# Altium schematic sheet Linear regulators.SchDoc (part 1 of 3)
size A3; Author: Mohamed Drissi; SheetNumber: 8; SheetTotal: 8
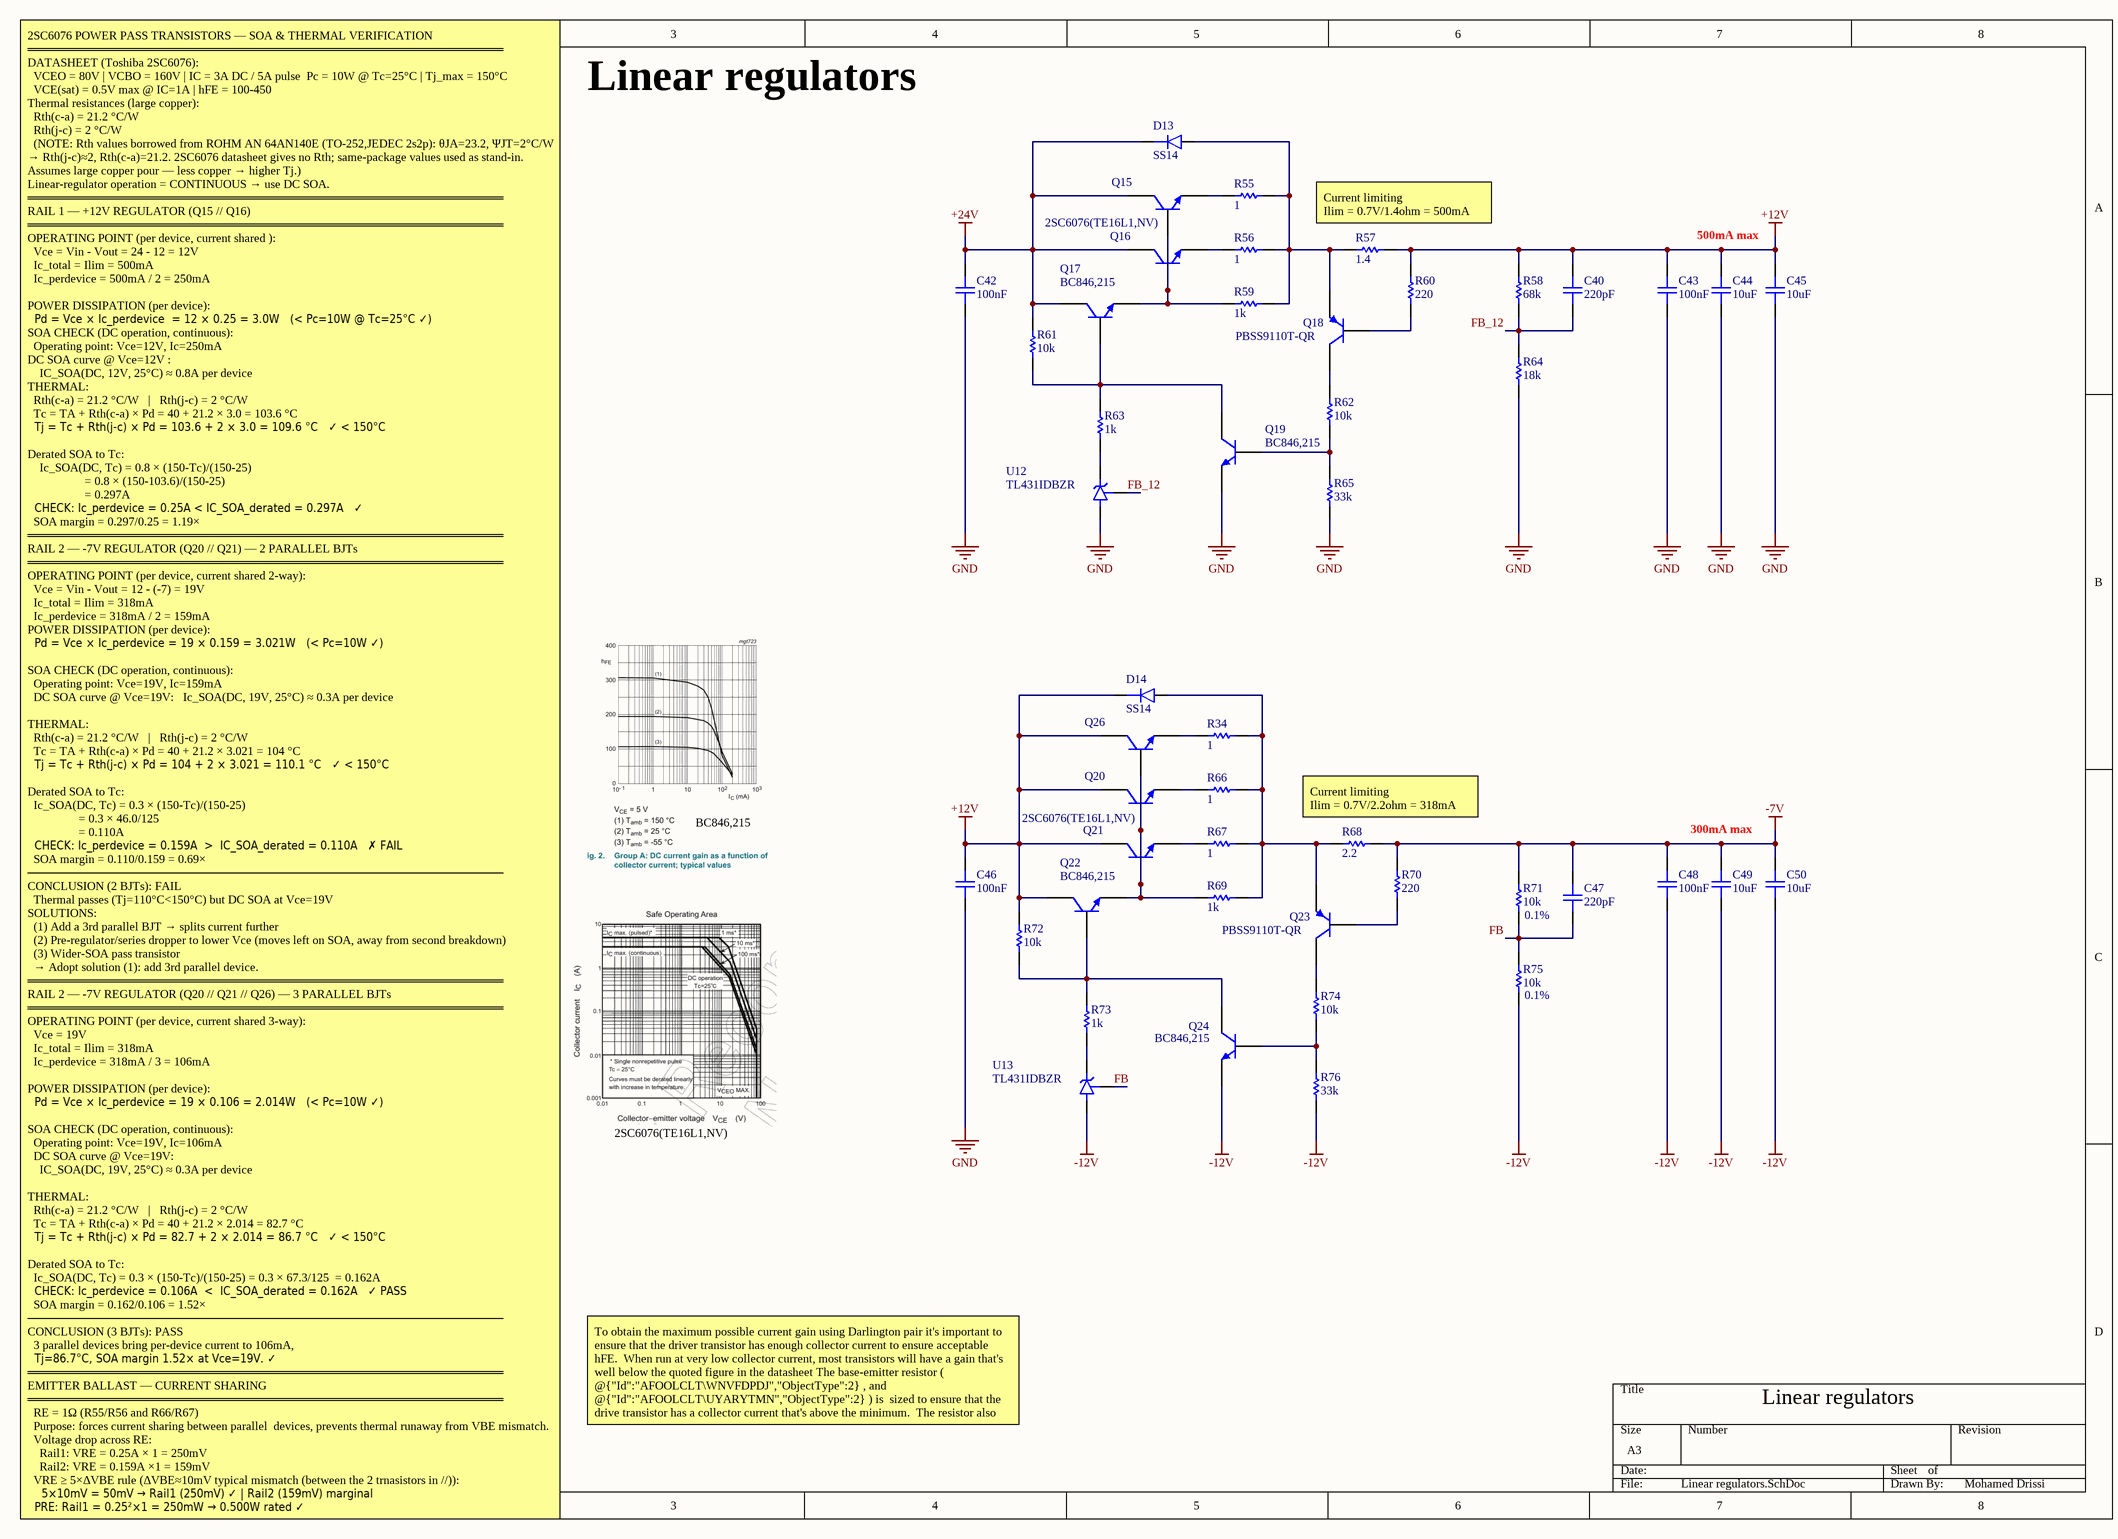
[diagram p0: Linear regulators.SchDoc]

## Parts
C40  Capacitance: 220pF  [cap_0603]  (hidden comment: CC0603JRNPO7BN221)
C42  Capacitance: 100nF  [cap_0603]  (hidden comment: GMC10X7R104K100NT)
C43  Capacitance: 100nF  [cap_0603]  (hidden comment: GMC10X7R104K100NT)
C44  Capacitance: 10uF  [cap_1210]  (hidden comment: 885012209073)
C45  Capacitance: 10uF  [cap_1210]  (hidden comment: 885012209073)
C46  Capacitance: 100nF  [cap_0603]  (hidden comment: GMC10X7R104K100NT)
C47  Capacitance: 220pF  [cap_0603]  (hidden comment: CC0603JRNPO7BN221)
C48  Capacitance: 100nF  [cap_0603]  (hidden comment: GMC10X7R104K100NT)
C49  Capacitance: 10uF  [cap_1210]  (hidden comment: 885012209073)
C50  Capacitance: 10uF  [cap_1210]  (hidden comment: 885012209073)
D13  SS14  [DO-214AC]
D14  SS14  [DO-214AC]
Q15  2SC6076(TE16L1,NV)  [TO-252  (DPAK)]  (value not drawn)
Q16  2SC6076(TE16L1,NV)  [TO-252  (DPAK)]
Q17  BC846,215  [sot23]
Q18  PBSS9110T-QR  [SOT23]
Q19  BC846,215  [sot23]
Q20  2SC6076(TE16L1,NV)  [TO-252  (DPAK)]  (value not drawn)
Q21  2SC6076(TE16L1,NV)  [TO-252  (DPAK)]
Q22  BC846,215  [sot23]
Q23  PBSS9110T-QR  [SOT23]
Q24  BC846,215  [sot23]
Q26  2SC6076(TE16L1,NV)  [TO-252  (DPAK)]  (value not drawn)
R34  Resistance: 1  [res_0603]  (hidden comment: RCS06031R00JNEA)
R55  Resistance: 1  [res_0603]  (hidden comment: RCS06031R00JNEA)
R56  Resistance: 1  [res_0603]  (hidden comment: RCS06031R00JNEA)
R57  Resistance: 1.4  [res_1206]  (hidden comment: CRCW12061R40FKEAHP)
R58  Resistance: 68k  [res_0603]  (hidden comment: CRGCQ0603J68K)
R59  Resistance: 1k  [res_0603]  (hidden comment: RC0603FR-071KL)
R60  Resistance: 220  [res_0603]  (hidden comment: CRGCQ0603J220R)
R61  Resistance: 10k  [res_0603]  (hidden comment: ERA-3AEB103V)
R62  Resistance: 10k  [res_0603]  (hidden comment: ERA-3AEB103V)
R63  Resistance: 1k  [res_0603]  (hidden comment: RC0603FR-071KL)
R64  Resistance: 18k  [res_0603]  (hidden comment: CRCW060318K0FKEAC)
R65  Resistance: 33k  [res_0603]  (hidden comment: RC0603JR-0733KL)
R66  Resistance: 1  [res_0603]  (hidden comment: RCS06031R00JNEA)
R67  Resistance: 1  [res_0603]  (hidden comment: RCS06031R00JNEA)
R68  Resistance: 2.2  [res_1206]  (hidden comment: CRM1206-JW-2R2ELF)
R69  Resistance: 1k  [res_0603]  (hidden comment: RC0603FR-071KL)
R70  Resistance: 220  [res_0603]  (hidden comment: CRGCQ0603J220R)
R71  Tolerance: 0.1%  Resistance: 10k  [res_0603]  (hidden comment: ERA-3AEB103V)
R72  Resistance: 10k  [res_0603]  (hidden comment: ERA-3AEB103V)
R73  Resistance: 1k  [res_0603]  (hidden comment: RC0603FR-071KL)
R74  Resistance: 10k  [res_0603]  (hidden comment: ERA-3AEB103V)
R75  Tolerance: 0.1%  Resistance: 10k  [res_0603]  (hidden comment: ERA-3AEB103V)
R76  Resistance: 33k  [res_0603]  (hidden comment: RC0603JR-0733KL)
U12  TL431IDBZR  [SOT-23-3]
U13  TL431IDBZR  [SOT-23-3]

## Nets
+12V: C40.2 C43.2 C44.2 C45.2 C46.2 D14.C Q20.2(C) Q21.2(C) Q22.3(C) Q26.2(C) R57.2 R58.2 R60.2 R72.2
+24V: C42.2 D13.C Q15.2(C) Q16.2(C) Q17.3(C) R61.2
-7V: C47.2 C48.2 C49.2 C50.2 R68.1 R70.2 R71.2
-12V: C48.1 C49.1 C50.1 Q24.2(E) R75.1 R76.1 U13.3(A)
GND: C42.1 C43.1 C44.1 C45.1 C46.1 Q19.2(E) R64.1 R65.1 U12.3(A)
FB: C47.1 R71.1 R75.2 U13.2(REF)
FB_12: C40.1 R58.1 R64.2 U12.2(REF)
NetD13_A: D13.A Q18.2(E) R55.2 R56.2 R57.1 R59.2
NetD14_A: D14.A Q23.2(E) R34.2 R66.2 R67.2 R68.2 R69.2
NetQ15_1: Q15.1(B) Q16.1(B) Q17.2(E) R59.1
NetQ15_3: Q15.3(E) R55.1
NetQ16_3: Q16.3(E) R56.1
NetQ17_1: Q17.1(B) Q19.3(C) R61.1 R63.2
NetQ18_1: Q18.1(B) R60.1
NetQ18_3: Q18.3(C) R62.2
NetQ19_1: Q19.1(B) R62.1 R65.2
NetQ20_1: Q20.1(B) Q21.1(B) Q22.2(E) Q26.1(B) R69.1
NetQ20_3: Q20.3(E) R66.1
NetQ21_3: Q21.3(E) R67.1
NetQ22_1: Q22.1(B) Q24.3(C) R72.1 R73.2
NetQ23_1: Q23.1(B) R70.1
NetQ23_3: Q23.3(C) R74.2
NetQ24_1: Q24.1(B) R74.1 R76.2
NetQ26_3: Q26.3(E) R34.1
NetR63_1: R63.1 U12.1(K)
NetR73_1: R73.1 U13.1(K)

## Notes on the sheet
- Linear regulators
- (near R57) Current limiting
  Ilim = 0.7V/1.4ohm = 500mA
- 500mA max
- BC846,215
- (near R68) Current limiting
  Ilim = 0.7V/2.2ohm = 318mA
- 300mA max
- 2SC6076(TE16L1,NV)
- To obtain the maximum possible current gain using Darlington pair it's important to ensure that the driver transistor has enough collector current to ensure acceptable hFE.  When run at very low collector current, most transistors will have a gain that's well below the quoted figure in the datasheet The base-emitter resistor ( @{"Id":"AFOOLCLT\WNVFDPDJ","ObjectType":2} , and @{"Id":"AFOOLCLT\UYARYTMN","ObjectType":2} ) is  sized to ensure that the drive transistor has a collector current that's above the minimum.  The resistor also helps to ensure a faster turn-off and minimises leakage current.
- 2SC6076 POWER PASS TRANSISTORS — SOA & THERMAL VERIFICATION
  ════════════════════════════════════════════════════════
  DATASHEET (Toshiba 2SC6076):
  VCEO = 80V | VCBO = 160V | IC = 3A DC / 5A pulse  Pc = 10W @ Tc=25°C | Tj_max = 150°C
  VCE(sat) = 0.5V max @ IC=1A | hFE = 100-450
  Thermal resistances (large copper):
  Rth(c-a) = 21.2 °C/W
  Rth(j-c) = 2 °C/W
  (NOTE: Rth values borrowed from ROHM AN 64AN140E (TO-252,JEDEC 2s2p): θJA=23.2, ΨJT=2°C/W → Rth(j-c)≈2, Rth(c-a)=21.2. 2SC6076 datasheet gives no Rth; same-package values used as stand-in. Assumes large copper pour — less copper → higher Tj.)
  Linear-regulator operation = CONTINUOUS → use DC SOA.
  ════════════════════════════════════════════════════════
  RAIL 1 — +12V REGULATOR (Q15 // Q16)
  ════════════════════════════════════════════════════════
  OPERATING POINT (per device, current shared ):
  Vce = Vin - Vout = 24 - 12 = 12V
  Ic_total = Ilim = 500mA
  Ic_perdevice = 500mA / 2 = 250mA
  POWER DISSIPATION (per device):
  Pd = Vce × Ic_perdevice  = 12 × 0.25 = 3.0W   (< Pc=10W @ Tc=25°C ✓)
  SOA CHECK (DC operation, continuous):
  Operating point: Vce=12V, Ic=250mA
  DC SOA curve @ Vce=12V :
  IC_SOA(DC, 12V, 25°C) ≈ 0.8A per device
  THERMAL:
  Rth(c-a) = 21.2 °C/W   |   Rth(j-c) = 2 °C/W
  Tc = TA + Rth(c-a) × Pd = 40 + 21.2 × 3.0 = 103.6 °C
  Tj = Tc + Rth(j-c) × Pd = 103.6 + 2 × 3.0 = 109.6 °C   ✓ < 150°C
  Derated SOA to Tc:
  Ic_SOA(DC, Tc) = 0.8 × (150-Tc)/(150-25)
  = 0.8 × (150-103.6)/(150-25)
  = 0.297A
  CHECK: Ic_perdevice = 0.25A < IC_SOA_derated = 0.297A   ✓
  SOA margin = 0.297/0.25 = 1.19×
  ════════════════════════════════════════════════════════
  RAIL 2 — -7V REGULATOR (Q20 // Q21) — 2 PARALLEL BJTs
  ════════════════════════════════════════════════════════
  OPERATING POINT (per device, current shared 2-way):
  Vce = Vin - Vout = 12 - (-7) = 19V
  Ic_total = Ilim = 318mA
  Ic_perdevice = 318mA / 2 = 159mA
  POWER DISSIPATION (per device):
  Pd = Vce × Ic_perdevice = 19 × 0.159 = 3.021W   (< Pc=10W ✓)
  SOA CHECK (DC operation, continuous):
  Operating point: Vce=19V, Ic=159mA
  DC SOA curve @ Vce=19V:   Ic_SOA(DC, 19V, 25°C) ≈ 0.3A per device
  THERMAL:
  Rth(c-a) = 21.2 °C/W   |   Rth(j-c) = 2 °C/W
  Tc = TA + Rth(c-a) × Pd = 40 + 21.2 × 3.021 = 104 °C
  Tj = Tc + Rth(j-c) × Pd = 104 + 2 × 3.021 = 110.1 °C   ✓ < 150°C
  Derated SOA to Tc:
  Ic_SOA(DC, Tc) = 0.3 × (150-Tc)/(150-25)
  = 0.3 × 46.0/125
  = 0.110A
  CHECK: Ic_perdevice = 0.159A  >  IC_SOA_derated = 0.110A   ✗ FAIL
  SOA margin = 0.110/0.159 = 0.69×
  ────────────────────────────────────────────────────────
  CONCLUSION (2 BJTs): FAIL
  Thermal passes (Tj=110°C<150°C) but DC SOA at Vce=19V
  SOLUTIONS:
  (1) Add a 3rd parallel BJT → splits current further
  (2) Pre-regulator/series dropper to lower Vce (moves left on SOA, away from second breakdown)
  (3) Wider-SOA pass transistor
  → Adopt solution (1): add 3rd parallel device.
  ════════════════════════════════════════════════════════
  RAIL 2 — -7V REGULATOR (Q20 // Q21 // Q26) — 3 PARALLEL BJTs
  ════════════════════════════════════════════════════════
  OPERATING POINT (per device, current shared 3-way):
  Vce = 19V
  Ic_total = Ilim = 318mA
  Ic_perdevice = 318mA / 3 = 106mA
  POWER DISSIPATION (per device):
  Pd = Vce × Ic_perdevice = 19 × 0.106 = 2.014W   (< Pc=10W ✓)
  SOA CHECK (DC operation, continuous):
  Operating point: Vce=19V, Ic=106mA
  DC SOA curve @ Vce=19V:
  IC_SOA(DC, 19V, 25°C) ≈ 0.3A per device
  THERMAL:
  Rth(c-a) = 21.2 °C/W   |   Rth(j-c) = 2 °C/W
  Tc = TA + Rth(c-a) × Pd = 40 + 21.2 × 2.014 = 82.7 °C
  Tj = Tc + Rth(j-c) × Pd = 82.7 + 2 × 2.014 = 86.7 °C   ✓ < 150°C
  Derated SOA to Tc:
  Ic_SOA(DC, Tc) = 0.3 × (150-Tc)/(150-25) = 0.3 × 67.3/125  = 0.162A
  CHECK: Ic_perdevice = 0.106A  <  IC_SOA_derated = 0.162A   ✓ PASS
  SOA margin = 0.162/0.106 = 1.52×
  ────────────────────────────────────────────────────────
  CONCLUSION (3 BJTs): PASS
  3 parallel devices bring per-device current to 106mA,
  Tj=86.7°C, SOA margin 1.52× at Vce=19V. ✓
  ════════════════════════════════════════════════════════
  EMITTER BALLAST — CURRENT SHARING
  ════════════════════════════════════════════════════════
  RE = 1Ω (R55/R56 and R66/R67)
  Purpose: forces current sharing between parallel  devices, prevents thermal runaway from VBE mismatch.
  Voltage drop across RE:
  Rail1: VRE = 0.25A × 1 = 250mV
  Rail2: VRE = 0.159A ×1 = 159mV
  VRE ≥ 5×ΔVBE rule (ΔVBE≈10mV typical mismatch (between the 2 trnasistors in //)):
  5×10mV = 50mV → Rail1 (250mV) ✓ | Rail2 (159mV) marginal
  PRE: Rail1 = 0.25²×1 = 250mW → 0.500W rated ✓
- Mohamed Drissi